# Altium schematic sheet Sheet1.SchDoc
size A2; SheetNumber: 1; SheetTotal: 1
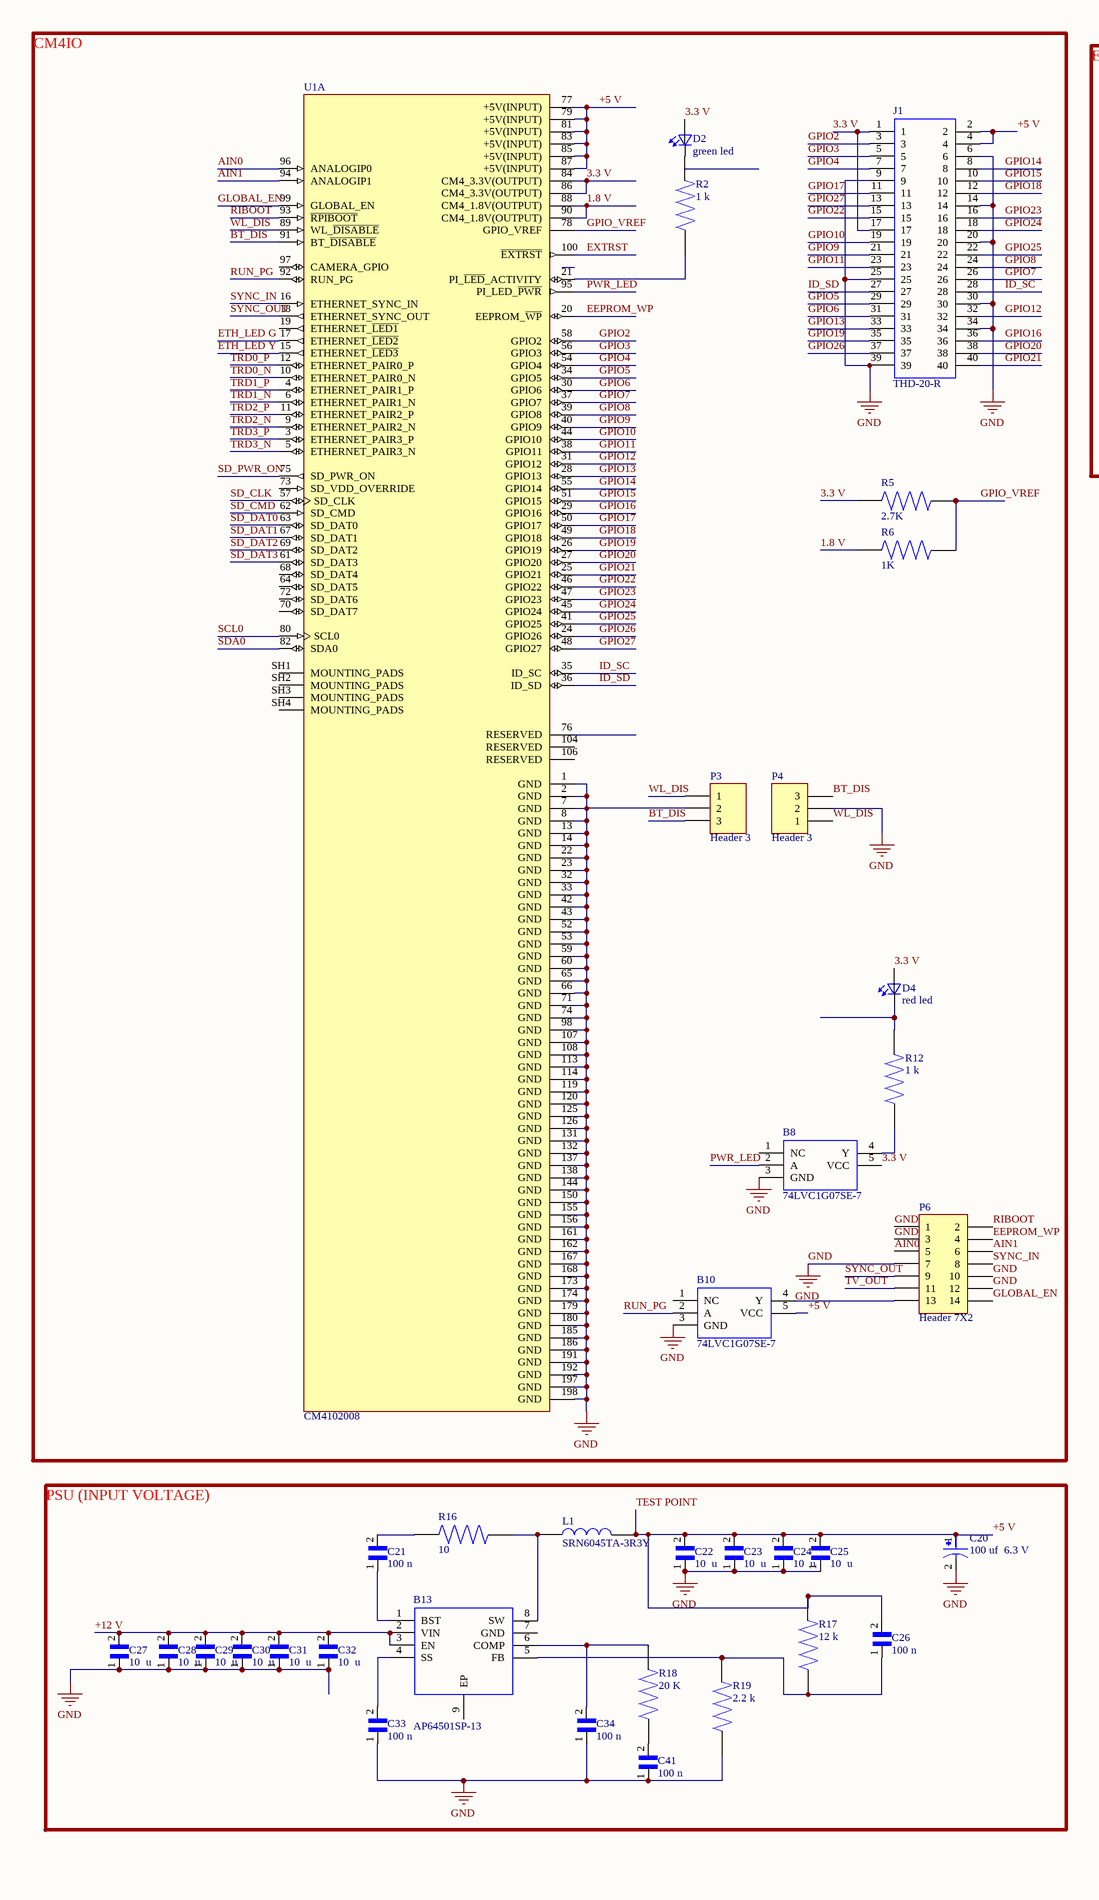
[diagram p0: Sheet1.SchDoc, left]
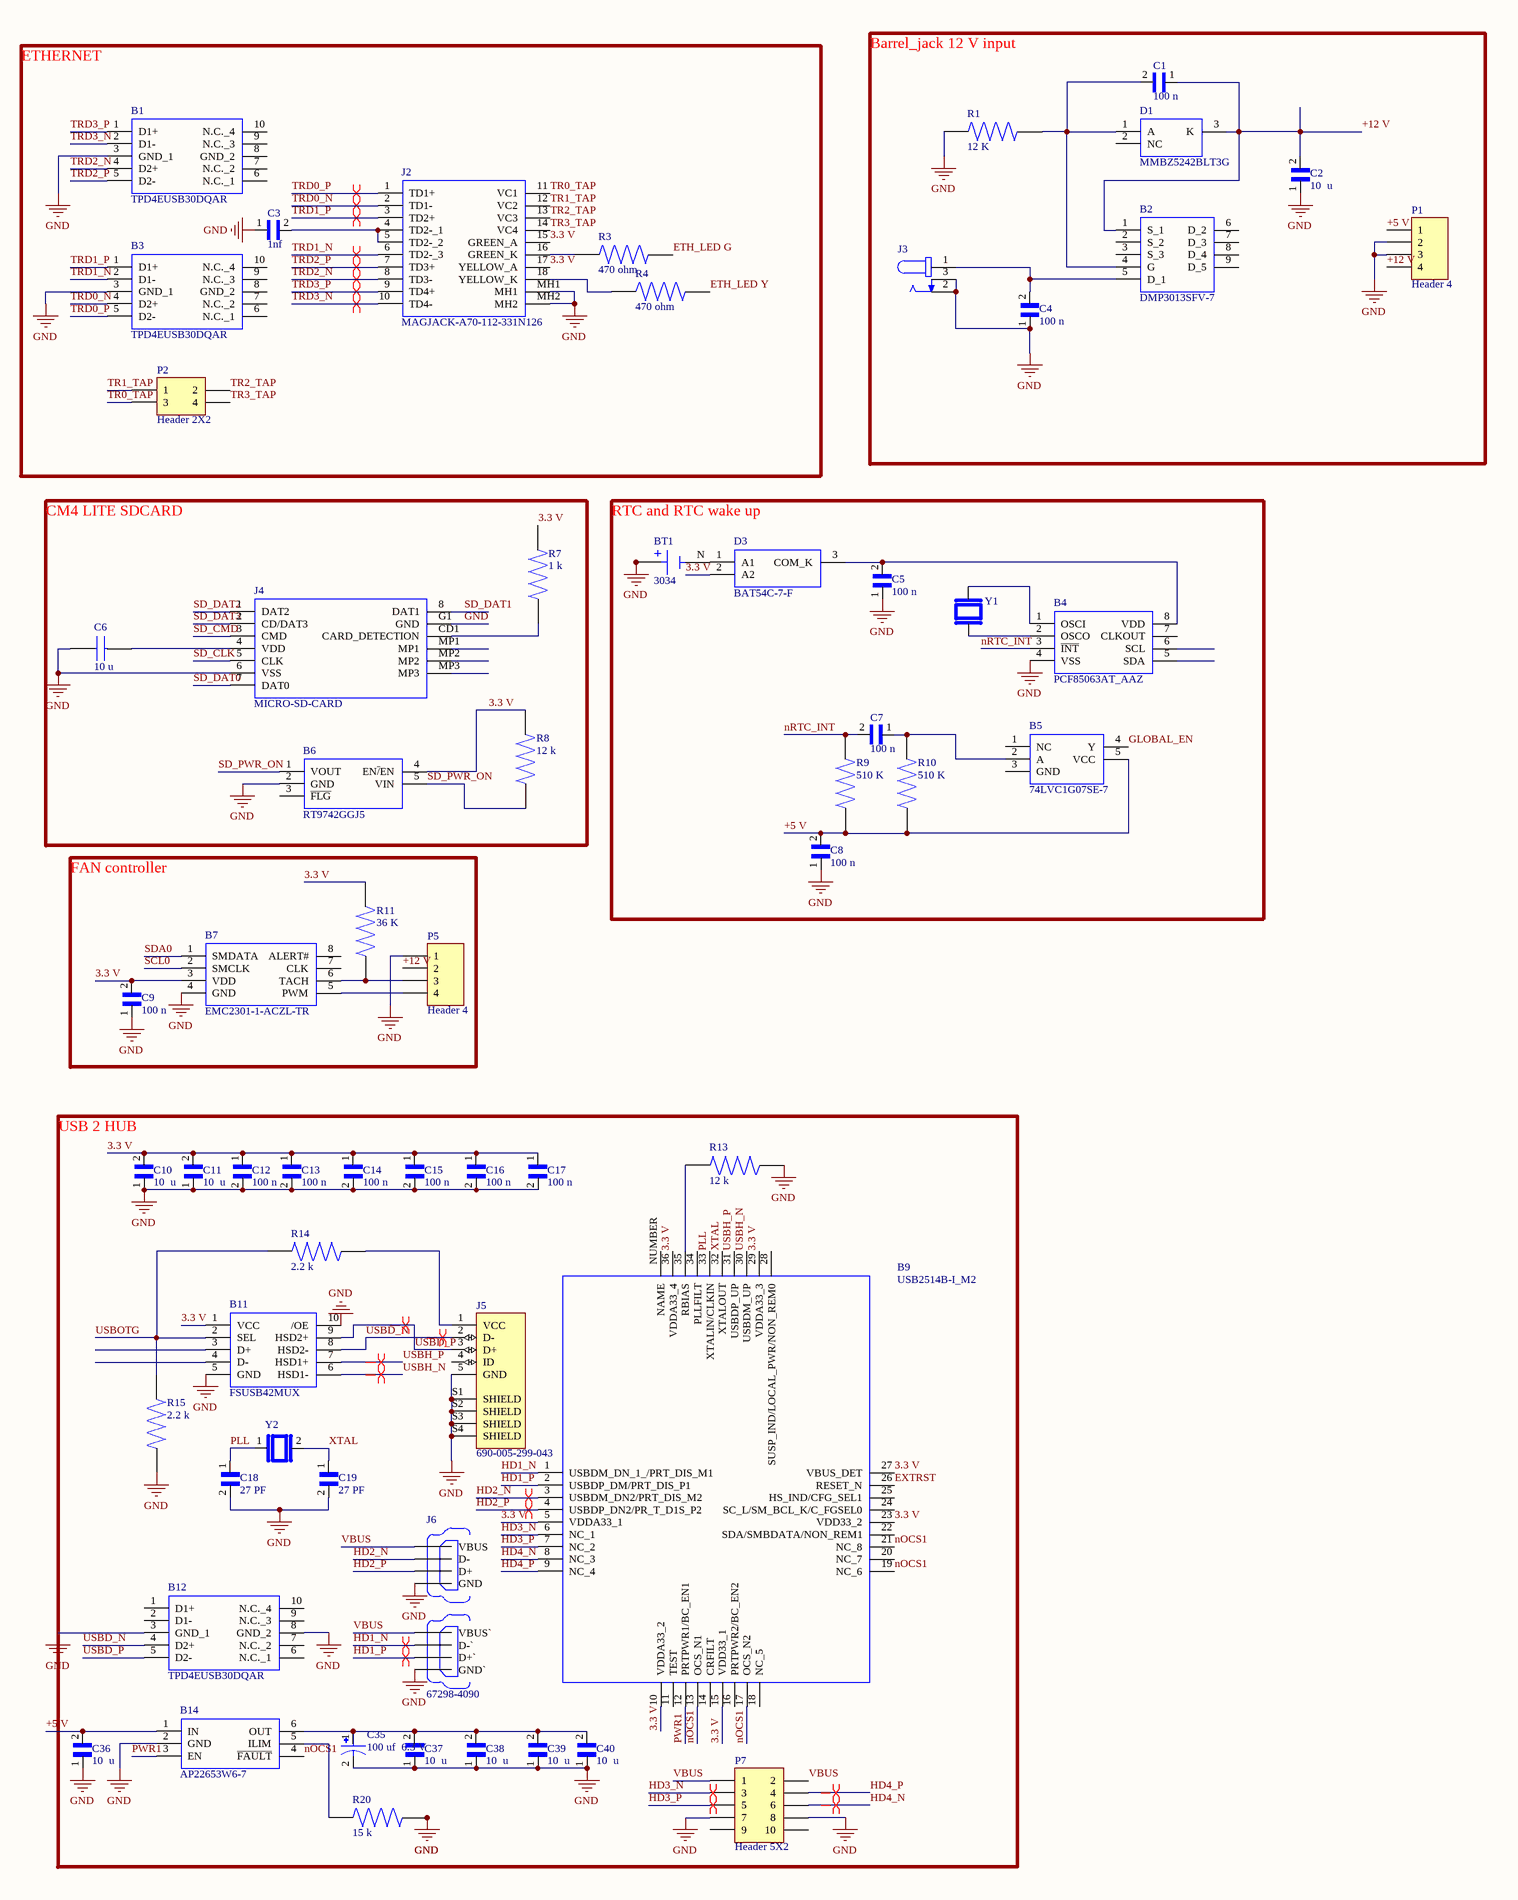
[diagram p1: Sheet1.SchDoc, right]

## Parts
B1  TPD4EUSB30DQAR  [DQA(R-PUSON-N10)]
B2  DMP3013SFV-7  [DMP3036SFV7]
B3  TPD4EUSB30DQAR  [DQA(R-PUSON-N10)]
B4  PCF85063AT_AAZ  [SOIC127P600X175-8N]
B5  74LVC1G07SE-7  [SOT65P210X110-5N]
B6  RT9742GGJ5  [SOT94P280X100-5N]
B7  EMC2301-1-ACZL-TR  [SOP65P490X110-8N]
B8  74LVC1G07SE-7  [SOT65P210X110-5N]
B9  USB2514B-I_M2  [QFN50P600X600X100-37N-D]
B10  74LVC1G07SE-7  [SOT65P210X110-5N]
B11  FSUSB42MUX  [SOP50P490X110-10N]
B12  TPD4EUSB30DQAR  [DQA(R-PUSON-N10)]
B13  AP64501SP-13  [SOIC127P600X163-9N]
B14  AP22653W6-7  [SOT95P280X145-6N]
BT1  3034  [BAT_3034]
C1  100 n  [CAPC1005X55N]
C2  10  u  [CAPC1005X55N]
C3  1nf  [CAPC1005X55N]
C4  100 n  [CAPC1005X55N]
C5  100 n  [CAPC1005X55N]
C6  10 u  [CAPC2012X145N]
C7  100 n  [CAPC1005X55N]
C8  100 n  [CAPC1005X55N]
C9  100 n  [CAPC1005X55N]
C10  10  u  [CAPC1005X55N]
C11  10  u  [CAPC1005X55N]
C12  100 n  [CAPC1005X55N]
C13  100 n  [CAPC1005X55N]
C14  100 n  [CAPC1005X55N]
C15  100 n  [CAPC1005X55N]
C16  100 n  [CAPC1005X55N]
C17  100 n  [CAPC1005X55N]
C18  27 PF  [CAPC1005X55N]
C19  27 PF  [CAPC1005X55N]
C20  100 uf  6.3 V  [CAPMP3528X210N]
C21  100 n  [CAPC1005X55N]
C22  10  u  [CAPC1005X55N]
C23  10  u  [CAPC1005X55N]
C24  10  u  [CAPC1005X55N]
C25  10  u  [CAPC1005X55N]
C26  100 n  [CAPC1005X55N]
C27  10  u  [CAPC1005X55N]
C28  10  u  [CAPC1005X55N]
C29  10  u  [CAPC1005X55N]
C30  10  u  [CAPC1005X55N]
C31  10  u  [CAPC1005X55N]
C32  10  u  [CAPC1005X55N]
C33  100 n  [CAPC1005X55N]
C34  100 n  [CAPC1005X55N]
C35  100 uf  6.3 V  [CAPMP3528X210N]
C36  10  u  [CAPC1005X55N]
C37  10  u  [CAPC1005X55N]
C38  10  u  [CAPC1005X55N]
C39  10  u  [CAPC1005X55N]
C40  10  u  [CAPC1005X55N]
C41  100 n  [CAPC1005X55N]
D1  MMBZ5242BLT3G  [SOT96P237X111-3N]
D2  green led  [0603]
D3  BAT54C-7-F  [SOT96P240X115-3N]
D4  red led  [0603]
J1  THD-20-R  [HDRV40W66P254_2X20_5080X500X890P]
J2  MAGJACK-A70-112-331N126  [EDAC_A70-112-331N126]
J3  DCJ200-10-A-XX-K_REVA  [GCT_DCJ200-10-A-XX-K_REVA]  (value not drawn)
J4  MICRO-SD-CARD  [MICROSDCARD]
J5  690-005-299-043  [EDAC_690-005-299-043]
J6  67298-4090  [MOLEX_67298-4090]
L1  SRN6045TA-3R3Y  [SRN6045TA330M]
P1  Header 4  [HDR1X4]
P2  Header 2X2  [HDR2X2]
P3  Header 3  [HDR1X3]
P4  Header 3  [HDR1X3]
P5  Header 4  [HDR1X4]
P6  Header 7X2  [HDR2X7]
P7  Header 5X2  [HDR2X5]
R1  12 K  [RESC2012X65N]
R2  1 k  [RESC1005X35N]
R3  470 ohm  [RESC2012X65N]
R4  470 ohm  [RESC2012X65N]
R5  2.7K  [RESC2012X65N]
R6  1K  [RESC2012X65N]
R7  1 k  [RESC1005X35N]
R8  12 k  [RESC2012X65N]
R9  510 K  [RESC1005X35N]
R10  510 K  [RESC1005X35N]
R11  36 K  [RESC1005X35N]
R12  1 k  [RESC1005X35N]
R13  12 k  [RESC2012X65N]
R14  2.2 k  [RESC2012X65N]
R15  2.2 k  [RESC2012X65N]
R16  10  [RESC2012X65N]
R17  12 k  [RESC2012X65N]
R18  20 K  [RESC2012X65N]
R19  2.2 k  [RESC1005X35N]
R20  15 k  [RESC2012X65N]
U1  CM4102008  [MODULE_CM4102008]  (part A of 2)
Y1  CM7V-T1A-32.768KHZ-12.5PF-10PPM-TB-QC  [XTAL_CM7V-T1A-32.768KHZ-12.5PF-10PPM-TB-QC]  (value not drawn)
Y2  FOXSDLF/240F-20  [XTAL_FOXSDLF/240F-20]  (value not drawn)

## Nets
GND: B1.3(GND_1) B3.3(GND_1) B4.4(VSS) B6.2(GND) B7.4(GND) B8.3(GND) B10.3(GND) B11.5(GND) B11.10(/OE) B12.3(GND_1) B12.8(GND_2) B14.2(GND) BT1.P1(POS) BT1.P2(POS) C2.1 C3.1 C4.1 C5.1 C6.1 C8.1 C9.1 C10.1 C11.1 C12.2 C13.2 C14.2 C15.2 C16.2 C17.2 C18.2 C19.2 C20.2 C22.1 C23.1 C24.1 C25.1 C27.1 C28.1 C29.1 C30.1 C31.1 C32.1 C33.1 C34.1 C35.2 C36.1 C37.1 C38.1 C39.1 C40.1 C41.1 J1.6 J1.9 J1.14 J1.20 J1.25 J1.30 J1.34 J1.39 J2.MH1 J2.MH2 J3.2 J3.3 J4.6(VSS) J4.G1(GND) J5.5(GND) J5.S1(SHIELD) J5.S2(SHIELD) J5.S3(SHIELD) J5.S4(SHIELD) J6.4(GND`) J6.8(GND) P1.2 P1.3 P3.2 P4.2 P5.1 P6.1 P6.3 P6.7 P6.10 P6.12 P7.7 P7.8 R1.1 R13.1 R15.2 R19.1 R20.2 U1.1(GND) U1.2(GND) U1.7(GND) U1.8(GND) U1.13(GND) U1.14(GND) U1.22(GND) U1.23(GND) U1.32(GND) U1.33(GND) U1.42(GND) U1.43(GND) U1.52(GND) U1.53(GND) U1.59(GND) U1.60(GND) U1.65(GND) U1.66(GND) U1.71(GND) U1.74(GND) U1.98(GND) U1.107(GND) U1.108(GND) U1.113(GND) U1.114(GND) U1.119(GND) U1.120(GND) U1.125(GND) U1.126(GND) U1.131(GND) U1.132(GND) U1.137(GND) U1.138(GND) U1.144(GND) U1.150(GND) U1.155(GND) U1.156(GND) U1.161(GND) U1.162(GND) U1.167(GND) U1.168(GND) U1.173(GND) U1.174(GND) U1.179(GND) U1.180(GND) U1.185(GND) U1.186(GND) U1.191(GND) U1.192(GND) U1.197(GND) U1.198(GND)
1.8 V: R6.1 U1.88(CM4_1.8V(OUTPUT)) U1.90(CM4_1.8V(OUTPUT))
3.3 V: B6.4(EN~{/}EN) B7.3(VDD) B8.5(VCC) B9.5(VDDA33_1) B9.10(VDDA33_2) B9.15(VDD33_1) B9.23(VDD33_2) B9.27(VBUS_DET) B9.29(VDDA33_3) B9.36(VDDA33_4) B11.1(VCC) C9.2 C10.2 C11.2 C12.1 C13.1 C14.1 C15.1 C16.1 C17.1 D2.2(A2) D3.2(A2) D4.2(A2) J1.1 J1.17 J2.15(GREEN_A) J2.17(YELLOW_A) R5.1 R7.2 R8.2 R11.2 U1.84(CM4_3.3V(OUTPUT)) U1.86(CM4_3.3V(OUTPUT))
+5 V: B5.5(VCC) B10.5(VCC) B14.1(IN) C8.2 C20.1 C22.2 C23.2 C24.2 C25.2 C26.2 C36.2 J1.2 J1.4 L1.2 P1.1 R9.1 R10.1 R17.2 U1.77(+5V(INPUT)) U1.79(+5V(INPUT)) U1.81(+5V(INPUT)) U1.83(+5V(INPUT)) U1.85(+5V(INPUT)) U1.87(+5V(INPUT))  [also labelled TEST POINT]
+12 V: B2.1(S_1) B13.2(VIN) B13.3(EN) C1.1 C2.2 C27.2 C28.2 C29.2 C30.2 C31.2 C32.2 D1.3(K) P1.4 P5.2
AIN0: P6.5 U1.96(ANALOGIP0)
AIN1: P6.6 U1.94(ANALOGIP1)
BT_DIS: P3.3 P4.3 U1.91(BT_~{DISABLE})
EEPROM_WP: P6.4 U1.20(EEPROM_~{WP})
ETH_LED G: R3.2 U1.17(ETHERNET_~{LED2})
ETH_LED Y: R4.2 U1.15(ETHERNET_~{LED3})
EXTRST: B9.26(RESET_N) U1.100(~{EXTRST})
GLOBAL_EN: B5.4(Y) P6.14 U1.99(GLOBAL_EN)
GPIO2: J1.3 U1.58(GPIO2)
GPIO3: J1.5 U1.56(GPIO3)
GPIO4: J1.7 U1.54(GPIO4)
GPIO5: J1.29 U1.34(GPIO5)
GPIO6: J1.31 U1.30(GPIO6)
GPIO7: J1.26 U1.37(GPIO7)
GPIO8: J1.24 U1.39(GPIO8)
GPIO9: J1.21 U1.40(GPIO9)
GPIO10: J1.19 U1.44(GPIO10)
GPIO11: J1.23 U1.38(GPIO11)
GPIO12: J1.32 U1.31(GPIO12)
GPIO13: J1.33 U1.28(GPIO13)
GPIO14: J1.8 U1.55(GPIO14)
GPIO15: J1.10 U1.51(GPIO15)
GPIO16: J1.36 U1.29(GPIO16)
GPIO17: J1.11 U1.50(GPIO17)
GPIO18: J1.12 U1.49(GPIO18)
GPIO19: J1.35 U1.26(GPIO19)
GPIO20: J1.38 U1.27(GPIO20)
GPIO21: J1.40 U1.25(GPIO21)
GPIO22: J1.15 U1.46(GPIO22)
GPIO23: J1.16 U1.47(GPIO23)
GPIO24: J1.18 U1.45(GPIO24)
GPIO25: J1.22 U1.41(GPIO25)
GPIO26: J1.37 U1.24(GPIO26)
GPIO27: J1.13 U1.48(GPIO27)
GPIO_VREF: R5.2 R6.2 U1.78(GPIO_VREF)
HD1_N: B9.1(USBDM_DN_1_/PRT_DIS_M1) J6.2(D-`)
HD1_P: B9.2(USBDP_DM/PRT_DIS_P1) J6.3(D+`)
HD2_N: B9.3(USBDM_DN2/PRT_DIS_M2) J6.6(D-)
HD2_P: B9.4(USBDP_DN2/PR_T_D1S_P2) J6.7(D+)
HD3_N: B9.6(NC_1) P7.3
HD3_P: B9.7(NC_2) P7.5
HD4_N: B9.8(NC_3) P7.6
HD4_P: B9.9(NC_4) P7.4
ID_SC: J1.28 U1.35(ID_SC)
ID_SD: J1.27 U1.36(ID_SD)
nOCS1: B9.13(OCS_N1) B9.17(OCS_N2) B9.19(NC_6) B9.21(NC_8) B14.4(~{FAULT})
nRTC_INT: B4.3(~{INT}) C7.2 R9.2
PLL: B9.33(XTALIN/CLKIN) C18.1 Y2.1
PWR1: B9.12(PRTPWR1/BC_EN1) B14.3(EN)
PWR_LED: B8.2(A) U1.95(PI_LED_~{PWR})
RIBOOT: P6.2 U1.93(~{RPIBOOT})
RUN_PG: B10.2(A) U1.92(RUN_PG)
SCL0: B7.2(SMCLK) U1.80(SCL0)
SD_CLK: J4.5(CLK) U1.57(SD_CLK)
SD_CMD: J4.3(CMD) U1.62(SD_CMD)
SD_DAT0: J4.7(DAT0) U1.63(SD_DAT0)
SD_DAT1: J4.8(DAT1) U1.67(SD_DAT1)
SD_DAT2: J4.1(DAT2) U1.69(SD_DAT2)
SD_DAT3: J4.2(CD/DAT3) U1.61(SD_DAT3)
SD_PWR_ON: B6.1(VOUT) B6.5(VIN) R8.1 U1.75(SD_PWR_ON)
SDA0: B7.1(SMDATA) U1.82(SDA0)
SYNC_IN: P6.8 U1.16(ETHERNET_SYNC_IN)
SYNC_OUT: P6.9 U1.18(ETHERNET_SYNC_OUT)
TR0_TAP: J2.11(VC1) P2.3
TR1_TAP: J2.12(VC2) P2.1
TR2_TAP: J2.13(VC3) P2.2
TR3_TAP: J2.14(VC4) P2.4
TRD0_N: B3.4(D2+) J2.2(TD1-) U1.10(ETHERNET_PAIR0_N)
TRD0_P: B3.5(D2-) J2.1(TD1+) U1.12(ETHERNET_PAIR0_P)
TRD1_N: B3.2(D1-) J2.6(TD2-_3) U1.6(ETHERNET_PAIR1_N)
TRD1_P: B3.1(D1+) J2.3(TD2+) U1.4(ETHERNET_PAIR1_P)
TRD2_N: B1.4(D2+) J2.8(TD3-) U1.9(ETHERNET_PAIR2_N)
TRD2_P: B1.5(D2-) J2.7(TD3+) U1.11(ETHERNET_PAIR2_P)
TRD3_N: B1.2(D1-) J2.10(TD4-) U1.5(ETHERNET_PAIR3_N)
TRD3_P: B1.1(D1+) J2.9(TD4+) U1.3(ETHERNET_PAIR3_P)
TV_OUT: P6.11
USBD_N: B11.8(HSD2-) B12.4(D2+) J5.2(D-)
USBD_P: B11.9(HSD2+) B12.5(D2-) J5.3(D+)
USBH_N: B9.30(USBDM_UP) B11.6(HSD1-)
USBH_P: B9.31(USBDP_UP) B11.7(HSD1+)
USBOTG: B11.2(SEL) R14.2 R15.1
VBUS: J6.1(VBUS`) J6.5(VBUS) P7.1 P7.2
WL_DIS: P3.1 P4.1 U1.89(WL_~{DISABLE})
XTAL: B9.32(XTALOUT) C19.1 Y2.2
NetB2_4: B2.4(G) C1.2 D1.1(A) R1.2
NetB2_5: B2.5(D_1) C4.2 J3.1
NetB4_1: B4.1(OSCI) Y1.2
NetB4_2: B4.2(OSCO) Y1.1
NetB4_8: B4.8(VDD) C5.2 D3.3(COM_K)
NetB5_2: B5.2(A) C7.1 R10.2
NetB7_5: B7.5(PWM) P5.4
NetB7_6: B7.6(TACH) P5.3 R11.1
NetB8_4: B8.4(Y) R12.1
NetB9_35: B9.35(RBIAS) R13.2
NetB10_4: B10.4(Y) P6.13
NetB13_1: B13.1(BST) C21.1
NetB13_4: B13.4(SS) C33.2
NetB13_5: B13.5(FB) C26.1 R17.1 R19.2
NetB13_6: B13.6(COMP) C34.2 R18.2
NetB13_8: B13.8(SW) L1.1 R16.2
NetB14_5: B14.5(ILIM) R20.1
NetB14_6: B14.6(OUT) C35.1 C37.2 C38.2 C39.2 C40.2
NetBT1_N: BT1.N(NEG) D3.1(A1)
NetC3_2: C3.2 J2.4(TD2-_1) J2.5(TD2-_2)
NetC6_2: C6.2 J4.4(VDD)
NetC21_2: C21.2 R16.1
NetC41_2: C41.2 R18.1
NetD2_1: D2.1(K2) R2.2
NetD4_1: D4.1(K2) R12.2
NetJ2_16: J2.16(GREEN_K) R3.1
NetJ2_18: J2.18(YELLOW_K) R4.1
NetJ4_CD1: J4.CD1(CARD_DETECTION) R7.1
NetJ5_1: J5.1(VCC) R14.1
NetR2_1: R2.1 U1.21(PI_~{LED}_ACTIVITY)

Not connected (* = marked no-connect by the designer): B1 6(N.C._1) 7(N.C._2) 8(GND_2) 9(N.C._3) 10(N.C._4); B2 2(S_2) 3(S_3) 6(D_2) 7(D_3) 8(D_4) 9(D_5); B3 6(N.C._1) 7(N.C._2) 8(GND_2) 9(N.C._3) 10(N.C._4); B4 5(SDA) 6(SCL) 7(CLKOUT); B5 1(NC) 3(GND); B6 3(~{FLG}); B7 7(CLK) 8(ALERT#); B8 1(NC); B9 11(TEST) 14(CRFILT) 16(PRTPWR2/BC_EN2) 18(NC_5) 20(NC_7) 22(SDA/SMBDATA/NON_REM1) 24(SC_L/SM_BCL_K/C_FGSEL0) 25(HS_IND/CFG_SEL1) 28(SUSP_IND/LOCAL_PWR/NON_REM0) 34(PLLFILT) NUMBER(NAME); B10 1(NC); B11 3(D+) 4(D-); B12 1(D1+) 2(D1-) 6(N.C._1) 7(N.C._2) 9(N.C._3) 10(N.C._4); B13 7(GND) 9(EP); D1 2(NC); J4 MP1 MP2 MP3; J5 4(ID); P7 9 10; U1 19(ETHERNET_~{LED1}) 64(SD_DAT5) 68(SD_DAT4) 70(SD_DAT7) 72(SD_DAT6) 73(SD_VDD_OVERRIDE) 76(RESERVED) 97(CAMERA_GPIO) 104(RESERVED) 106(RESERVED) SH1(MOUNTING_PADS) SH2(MOUNTING_PADS) SH3(MOUNTING_PADS) SH4(MOUNTING_PADS)

## Layout directives
differential pair: HD1_N, HD1_P, HD2_N, HD2_P, HD3_N, HD3_P, HD4_N, HD4_P, TRD0_N, TRD0_P, TRD1_N, TRD1_P, TRD2_N, TRD2_P, TRD3_N, TRD3_P, USBD_N, USBD_P, USBH_N, USBH_P

## Notes on the sheet
- Barrel_jack 12 V input
- ETHERNET
- CM4 LITE SDCARD
- RTC and RTC wake up
- FAN controller
- CM4IO
- PSU (INPUT VOLTAGE)
- USB 2 HUB

## Library data of the parts
B1 B3 B12 = TPD4EUSB30DQAR: Texas Instruments TPD4EUSB30DQAR, USB Controller, 6Gbit/s, USB 3.0, 10-Pin SON; Manufacturer_Name: Texas Instruments; Manufacturer_Part_Number: TPD4EUSB30DQAR; Mouser Part Number: 595-TPD4EUSB30DQAR; Mouser Price/Stock: https://www.mouser.co.uk/ProductDetail/Texas-Instruments/TPD4EUSB30DQAR?qs=Ze4%2FuFuz19JpY4uqYOLMbQ%3D%3D; Arrow Part Number: TPD4EUSB30DQAR; Arrow Price/Stock: https://www.arrow.com/en/products/tpd4eusb30dqar/texas-instruments?utm_currency=USD&region=nac; Datasheet Link: http://www.ti.com/lit/gpn/tpd4eusb30
B2 = DMP3013SFV-7: Trans MOSFET P-CH 30V 12A 8-Pin PowerDI EP T/R; Manufacturer_Name: Diodes Incorporated; Manufacturer_Part_Number: DMP3013SFV-7; Mouser Part Number: 621-DMP3013SFV-7; Mouser Price/Stock: https://www.mouser.co.uk/ProductDetail/Diodes-Incorporated/DMP3013SFV-7?qs=W0yvOO0ixfH1hnmiAtL1VQ%3D%3D; Arrow Part Number: DMP3013SFV-7; Arrow Price/Stock: https://www.arrow.com/en/products/dmp3013sfv-7/diodes-incorporated?utm_currency=USD&region=nac; Datasheet Link: https://www.diodes.com//assets/Datasheets/DMP3013SFV.pdf
B4 = PCF85063AT_AAZ: Real Time Clock Low Power Real time clocks; Manufacturer_Name: NXP; Manufacturer_Part_Number: PCF85063AT/AAZ; Geometry.Height: 1.75mm; Mouser Part Number: 771-PCF85063AT/AAZ; Mouser Price/Stock: https://www.mouser.co.uk/ProductDetail/NXP-Semiconductors/PCF85063AT-AAZ?qs=sV%252BQJnSpgu9E5WpV9lmUdg%3D%3D; Arrow Part Number: PCF85063AT/AAZ; Arrow Price/Stock: https://www.arrow.com/en/products/pcf85063ataaz/nxp-semiconductors?region=nac; Datasheet Link: http://www.nxp.com/docs/en/data-sheet/PCF85063A.pdf
B5 B8 B10 = 74LVC1G07SE-7: Buffers & Line Drivers Single Gate Open Out 1.65 to 5.5V 32mA; Manufacturer_Name: Diodes Incorporated; Geometry.Height: 1.1mm; Manufacturer_Part_Number: 74LVC1G07SE-7; Mouser Part Number: 621-74LVC1G07SE-7; Mouser Price/Stock: https://www.mouser.co.uk/ProductDetail/Diodes-Incorporated/74LVC1G07SE-7?qs=abZ1nkZpTuNoZmx9wrxFdA%3D%3D; Arrow Part Number: 74LVC1G07SE-7; Arrow Price/Stock: https://www.arrow.com/en/products/74lvc1g07se-7/diodes-incorporated?utm_currency=USD&region=europe; Datasheet Link: https://www.diodes.com//assets/Datasheets/74LVC1G07.pdf
B6 = RT9742GGJ5: POWER LOAD SWITCH, HIGH SIDE, TSOT-23-5; Power Load Switch Type:High Side; Input Voltage:6V; Current Limit:1.1A; On State Resistance:0.07ohm; Distribution Switch Case Style:TSOT-23; No. of Pins:5Pins; Thermal Protection:Yes; On / RoHS Compliant: Yes; Manufacturer_Name: RICHTEK; Geometry.Height: 1mm; Manufacturer_Part_Number: RT9742GGJ5; Mouser Part Number: 835-RT9742GGJ5; Mouser Price/Stock: https://www.mouser.co.uk/ProductDetail/Richtek/RT9742GGJ5?qs=amGC7iS6iy%2FZU2tAnLZxIA%3D%3D; Arrow Part Number: *; Arrow Price/Stock: *; Datasheet Link: https://componentsearchengine.com/Datasheets/2/RT9742GGJ5.pdf
B7 = EMC2301-1-ACZL-TR: RPM-Based PWM Fan Speed Controller MSOP8; Manufacturer_Name: Microchip; Geometry.Height: 1.1mm; Manufacturer_Part_Number: EMC2301-1-ACZL-TR; Mouser Part Number: 886-EMC2301-1-ACZLTR; Mouser Price/Stock: https://www.mouser.co.uk/ProductDetail/Microchip-Technology/EMC2301-1-ACZL-TR?qs=pA5MXup5wxFdFYiBpDRrfw%3D%3D; Arrow Part Number: EMC2301-1-ACZL-TR; Arrow Price/Stock: https://www.arrow.com/en/products/emc2301-1-aczl-tr/microchip-technology?region=nac; Datasheet Link: http://www.microchip.com/mymicrochip/filehandler.aspx?ddocname=en562400
B9 = USB2514B-I_M2: Microchip USB2514B-I/M2, USB Controller, USB 2.0, 3.3 V, 36-Pin SQFN; Geometry.Height: 1mm; Manufacturer_Name: Microchip; Manufacturer_Part_Number: USB2514B-I/M2; Mouser Part Number: 579-USB2514B-I/M2; Mouser Price/Stock: https://www.mouser.co.uk/ProductDetail/Microchip-Technology/USB2514B-I-M2?qs=uus7iwvxYD%252BYUekNs2mWlw%3D%3D; Arrow Part Number: USB2514B-I/M2; Arrow Price/Stock: https://www.arrow.com/en/products/usb2514b-im2/microchip-technology?region=nac; Datasheet Link: http://ww1.microchip.com/downloads/en/DeviceDoc/00001692C.pdf
B11 = FSUSB42MUX: 15A Maximum ICCT over and Expanded Control Voltage Range (VIN= 1.8V, VCC= 4.3V) ; Packaged in: ; Low On Resistance: 3.9 Typical ; 8kV ESD Rating, >16kV Power/GND ESD Rating ; 10-Lead MSOP ; Low Power Consumption: 1A Maximum ; Wide -3dB Bandwitch: > 720MHz ; Low On Capacitance: 3.7pF Typical ; Over-Voltage Tolerance (OVT) on all USB Ports Up to 5.25V without External Components; 10-Lead UMLP (1.4 x 1.8mm); Manufacturer_Name: onsemi; Geometry.Height: 1.1mm; Manufacturer_Part_Number: FSUSB42MUX; Mouser Part Number: 512-FSUSB42MUX; Mouser Price/Stock: https://www.mouser.co.uk/ProductDetail/onsemi-Fairchild/FSUSB42MUX?qs=yA6kp8fx8Y59RAD4iJDRWg%3D%3D; Arrow Part Number: FSUSB42MUX; Arrow Price/Stock: https://www.arrow.com/en/products/fsusb42mux/on-semiconductor?utm_currency=USD&region=nac; Datasheet Link: https://www.onsemi.com/pub/Collateral/FSUSB42-D.PDF
B13 = AP64501SP-13: Conv DC-DC 3.8V to 40V Synchronous Step Down Single-Out 0.8V to 39V 5A 8-Pin SO EP T/R; Manufacturer_Name: Diodes Incorporated; Geometry.Height: 1.63mm; Manufacturer_Part_Number: AP64501SP-13; Mouser Part Number: 621-AP64501SP-13; Mouser Price/Stock: https://www.mouser.co.uk/ProductDetail/Diodes-Incorporated/AP64501SP-13?qs=P1JMDcb91o7FS0GU%252BW7TIQ%3D%3D; Arrow Part Number: AP64501SP-13; Arrow Price/Stock: https://www.arrow.com/en/products/ap64501sp-13/diodes-incorporated?utm_currency=USD&region=nac; Datasheet Link: https://www.diodes.com//assets/Datasheets/AP64501.pdf
B14 = AP22653W6-7: Power Switch ICs - Power Distribution 1-Ch Precision Curr-Limit Load SW; Manufacturer_Name: Diodes Incorporated; Geometry.Height: 1.45mm; Manufacturer_Part_Number: AP22653W6-7; Mouser Part Number: 621-AP22653W6-7; Mouser Price/Stock: https://www.mouser.co.uk/ProductDetail/Diodes-Incorporated/AP22653W6-7?qs=rkhjVJ6%2F3ELFrpB7eThLLg%3D%3D; Arrow Part Number: AP22653W6-7; Arrow Price/Stock: null?region=asia; Datasheet Link: https://www.diodes.com//assets/Datasheets/AP22652_53_52A_53A.pdf
BT1 = 3034: SMT Holder for 20mm Cell-Tin Nickel Plate; MF: Keystone Electronics Corp.; SnapEDA_Link: https://www.snapeda.com/parts/3034/Keystone+Electronics/view-part/?ref=snap; Price: None; MP: 3034; Check_prices: https://www.snapeda.com/parts/3034/Keystone+Electronics/view-part/?ref=eda; Availability: Not in stock; Value: *; Package: None
C1 C3-C5 C7-C9 C12-C19 C21 C26 C33 C34 C41 = C1005X7R1C104M050BC: C Series 0402 0.1 uF 16 V Â±20 % Tolerance X7R SMT Multilayer Ceramic Capacitor; MF: TDK; MP: C1005X7R1C104M050BC; SnapEDA_Link: https://www.snapeda.com/parts/C1005X7R1C104M050BC/TDK/view-part/?ref=snap; Check_prices: https://www.snapeda.com/parts/C1005X7R1C104M050BC/TDK/view-part/?ref=eda; Price: None; Availability: In Stock; Purchase-URL: https://pricing.snapeda.com/search/part/C1005X7R1C104M050BC/?ref=eda; Package: 1005 TDK; Value: *
C2 C10 C11 C22-C25 C27-C32 C36-C40 = C2012X6S1C106K125AC: C Series 0805 10 uF 16 V Â±10 % Tolerance X6S SMT Multilayer Ceramic Capacitor; MF: TDK; MP: C2012X6S1C106K125AC; SnapEDA_Link: https://www.snapeda.com/parts/C2012X6S1C106K125AC/TDK-Lambda+Americas+Inc/view-part/?ref=snap; Check_prices: https://www.snapeda.com/parts/C2012X6S1C106K125AC/TDK-Lambda+Americas+Inc/view-part/?ref=eda; Value: *; Purchase-URL: https://pricing.snapeda.com/search/part/C2012X6S1C106K125AC/?ref=eda; Package: 2012 TDK
C6 = GRM21BC8YA106ME11L: Multilayer Ceramic Capacitors MLCC - SMD/SMT 0805 10uF 35volts *Derate Voltage/Temp; Manufacturer_Name: Murata Electronics; Geometry.Height: 1.45mm; Mouser Part Number: 81-GRM21BC8YA106ME1L; Mouser Price/Stock: https://www.mouser.co.uk/ProductDetail/Murata-Electronics/GRM21BC8YA106ME11L?qs=K0Sa7bCb58JXd%2FLXsBufTg%3D%3D; Manufacturer_Part_Number: GRM21BC8YA106ME11L; Datasheet Link: https://search.murata.co.jp/Ceramy/image/img/A01X/G101/ENG/GRM21BC8YA106ME11-01A.pdf
C20 C35 = T543B107K006AHW025: 100 ÂµF Molded Tantalum Polymer Capacitor 6.3 V 1411 (3528 Metric) 25mOhm @ 100kHz; MF: KEMET; SnapEDA_Link: https://www.snapeda.com/parts/T543B107K006AHW025/KEMET/view-part/?ref=snap; Package: SMD-2 Kemet; Value: *; MP: T543B107K006AHW025; Check_prices: https://www.snapeda.com/parts/T543B107K006AHW025/KEMET/view-part/?ref=eda
D1 = MMBZ5242BLT3G: 225 mW Rating on FR-4 or FR-5 Board; Zener Voltage Range - 2.4 V to 91 V; Package Designed for Optimal Automated Board Assembly; Small Package Size for High Density Applications; ESD Rating of Class 3 (>16 KV) per Human Body Model Mechanical Characteristics; CASE: Void-free, transfer-molded, thermosetting plastic case; FINISH: Corrosion resistant finish, easily solderable; MAXIMUM CASE TEMPERATURE FOR SOLDERING PURPOSES: 260C for 10 Seconds; POLARITY: Cathode indicated by polarity band; FLAMMABILITY RATING:; Manufacturer_Name: onsemi; Geometry.Height: 1.11mm; Manufacturer_Part_Number: MMBZ5242BLT3G; Mouser Part Number: 863-MMBZ5242BLT3G; Mouser Price/Stock: https://www.mouser.co.uk/ProductDetail/onsemi/MMBZ5242BLT3G?qs=P4IOph%252Bbot8zm7%252BOlKh6Qw%3D%3D; Arrow Part Number: MMBZ5242BLT3G; Arrow Price/Stock: https://www.arrow.com/en/products/mmbz5242blt3g/on-semiconductor?utm_currency=USD&region=nac; Datasheet Link: https://www.onsemi.com/pub/Collateral/MMBZ5221BLT1-D.PDF
D2 = LTST-S270KGKT: Green 571nm LED Indication - Discrete 2V 0603 _1608 Metric_; MF: Lite-On Inc.; MP: LTST-S270KGKT; Availability: Unavailable; SnapEDA_Link: https://www.snapeda.com/parts/LTST-S270KGKT/Lite-On%20Inc./view-part/268457/?ref=snap; Package: 0603 Lite-On; Price: None; Value: *
D3 = BAT54C-7-F: DiodesZetex   ,  30V, 3 SOT-23,  +150 C; Manufacturer_Name: Diodes Incorporated; Geometry.Height: 1.15mm; Manufacturer_Part_Number: BAT54C-7-F; Mouser Part Number: 621-BAT54C-F; Mouser Price/Stock: https://www.mouser.co.uk/ProductDetail/Diodes-Incorporated/BAT54C-7-F?qs=A%2FGeX6qn32NJhN9M%2F3GNcA%3D%3D; Arrow Part Number: BAT54C-7-F; Arrow Price/Stock: https://www.arrow.com/en/products/bat54c-7-f/diodes-incorporated?utm_currency=USD&region=nac; Datasheet Link: https://www.diodes.com//assets/Datasheets/BAT54_A_C_S.pdf
D4 = LTST-S270KRKT: http://octopart.com/ltst-c190tbkt-lite-on-550003; MF: {'manufacturer': u'Lite-On Inc.'}; Package: None; Price: None; Value: *; MP: LTST-S270KRKT; Availability: Unavailable
J1 = THD-20-R: 2.54MM ... PRPC040SBAN-M71RC, CONN HEADER R/A 40POS 2.54MM, Header, Breakaway, Male Pin, 0.100" (2.54mm), 40,; Manufacturer_Name: valcon; Geometry.Height: 8.9mm; Manufacturer_Part_Number: THD-20-R; Mouser Part Number: *; Mouser Price/Stock: *; Arrow Part Number: *; Arrow Price/Stock: *; Datasheet Link: https://datasheet.octopart.com/THD-20-R-Valcon-datasheet-116534095.pdf
J2 = MAGJACK-A70-112-331N126: 1 Port RJ45 Magjack Connector Through Hole 10/100 Base-T, AutoMDIX; Manufacturer_Name: Bel Magnetic Solutions; Geometry.Height: 13.3mm; Manufacturer_Part_Number: MAGJACK-A70-112-331N126; Mouser Part Number: *; Mouser Price/Stock: *; Arrow Part Number: *; Arrow Price/Stock: *; Datasheet Link: http://www.link-pp.com/upload/file/20180411/20180411182938293829.pdf
J3 = DCJ200-10-A-XX-K_REVA: Power Barrel Connector Jack 2.05mm ID (0.081), 5.50mm OD (0.217) Through Hole, Right Angle; MF: Global Connector Technology; MP: DCJ200-10-A-K1-K; SnapEDA_Link: https://www.snapeda.com/parts/DCJ200-10-A-K1-K/Global+Connector+Technology/view-part/?ref=snap; Package: None; Value: *; Check_prices: https://www.snapeda.com/parts/DCJ200-10-A-K1-K/Global+Connector+Technology/view-part/?ref=eda
J4 = MICRO-SD-CARD: Memory Card Connectors MICRO SD CARD CONNECTOR WITH PUSH PUSH EJECT ACTION; Manufacturer_Name: Olimex Ltd.; Geometry.Height: 2mm; Manufacturer_Part_Number: MICRO-SD-CARD; Mouser Part Number: N/A; Mouser Price/Stock: https://www.mouser.co.uk/ProductDetail/Olimex-Ltd/MICRO-SD-CARD?qs=Rp5uXu7WBW8fXUZTWj6z0w%3D%3D; Arrow Part Number: *; Arrow Price/Stock: *; Datasheet Link: https://www.olimex.com/Products/Components/Connectors/MICRO-SD-CARD/resources/MICRO-SDCARD-1.jpg
J5 = 690-005-299-043: USB - mini B USB 2.0 Receptacle Connector 5 Position Surface Mount, Right Angle; MF: EDAC Inc.; Price: None; Purchase-URL: https://pricing.snapeda.com/search/part/690-005-299-043/?ref=eda; Check_prices: https://www.snapeda.com/parts/690-005-299-043/EDAC%20Inc./view-part/347309/?ref=eda; Value: *; SnapEDA_Link: https://www.snapeda.com/parts/690-005-299-043/EDAC%20Inc./view-part/347309/?ref=snap; Availability: Good; MP: 690-005-299-043; Package: None
J6 = 67298-4090: USB-A (USB TYPE-A), Stacked - Receptacle Connector 8 Position Through Hole, Right Angle; MF: Molex; Check_prices: https://www.snapeda.com/parts/67298-4090/Molex/view-part/?ref=eda; Value: *; Purchase-URL: https://pricing.snapeda.com/search/part/67298-4090/?ref=eda; Price: None; MP: 67298-4090; SnapEDA_Link: https://www.snapeda.com/parts/67298-4090/Molex/view-part/?ref=snap; Availability: In Stock; Package: None
L1 = SRN6045TA-3R3Y: BOURNS - SRN6045TA-3R3Y - INDUCTOR, AEC-Q200, 3.3UH, 5A, 30% Semi-shielded Power Inductors; Geometry.Height: 4.5mm; Manufacturer_Name: Bourns; Manufacturer_Part_Number: SRN6045TA-3R3Y; Mouser Part Number: 652-SRN6045TA-3R3Y; Mouser Price/Stock: https://www.mouser.co.uk/ProductDetail/Bourns/SRN6045TA-3R3Y?qs=Vt59ZOdFuWZ4MyJAxNBCDg%3D%3D; Arrow Part Number: SRN6045TA-3R3Y; Arrow Price/Stock: https://www.arrow.com/en/products/srn6045ta-3r3y/bourns?utm_currency=USD&region=europe; Datasheet Link: http://www.bourns.com/docs/Product-Datasheets/SRN6045TA.pdf
P1 P5 = Header 4: Header, 4-Pin; LatestRevisionDate: 17-Jul-2002; LatestRevisionNote: Re-released for DXP Platform.; Publisher: Altium Limited
P2 = Header 2X2: Header, 2-Pin, Dual row; LatestRevisionDate: 17-Jul-2002; LatestRevisionNote: Re-released for DXP Platform.; Publisher: Altium Limited
P3 P4 = Header 3: Header, 3-Pin; LatestRevisionDate: 17-Jul-2002; LatestRevisionNote: Re-released for DXP Platform.; Publisher: Altium Limited
P6 = Header 7X2: Header, 7-Pin, Dual row; LatestRevisionDate: 17-Jul-2002; LatestRevisionNote: Re-released for DXP Platform.; Publisher: Altium Limited
P7 = Header 5X2: Header, 5-Pin, Dual row; LatestRevisionDate: 17-Jul-2002; LatestRevisionNote: Re-released for DXP Platform.; Publisher: Altium Limited
R1 R8 R13-R15 R17 R18 R20 = CPF0402B12K1E1: Surface Mount Thin Film Resistor, Cpf Series, 12.1 Kohm, 63 Mw, - 0.1%, 25 V; Package: None; Price: None; Value: *; MP: CPF0402B12K1E1; Availability: Unavailable
R2 R7 R9-R12 = CPF0402B1K1E1: CPF 0402 1K1 0.1% 25PPM 1K RL; Package: None; Price: None; Value: *; MP: CPF0402B1K1E1; Availability: Unavailable
R3 R4 = CPF0402B470RE1: CPF 0402 470R 0.1% 25PPM 1K RL; Package: None; Price: None; Value: *; MP: CPF0402B470RE1; Availability: Unavailable
R5 = CPF0805B2K7E1: RES SMD 2.7K OHM 0.1% 1/10W 0805; Package: None; Price: None; Value: *; MP: CPF0805B2K7E1; Availability: Unavailable
R6 R16 = CPF0805B20RE1: CPF 0805 20R 0.1% 25PPM 1K RL; Package: None; Price: None; Value: *; MP: CPF0805B20RE1; Availability: Unavailable
R19 = CPF0402B2K1E1: CPF 0402 2K1 0.1% 25PPM 1K RL; Package: None; Price: None; Value: *; MP: CPF0402B2K1E1; Availability: Unavailable
U1 = CM4102008: Raspberry Pi Compute Module 4 with WiFi 2GB RAM 8GB Flash | Raspberry Pi CM4102008; SnapEDA_Link: https://www.snapeda.com/parts/CM4102008/Raspberry+Pi/view-part/?ref=snap; Package: None; Value: *; MF: Raspberry Pi; MP: CM4102008; Check_prices: https://www.snapeda.com/parts/CM4102008/Raspberry+Pi/view-part/?ref=eda
Y1 = CM7V-T1A-32.768KHZ-12.5PF-10PPM-TB-QC: Tuning Fork Crystal 32.768kHz in SMD 1.5 x 3.2 mm package; MF: Micro Crystal; SnapEDA_Link: https://www.snapeda.com/parts/CM7V-T1A-32.768KHZ-12.5PF-10PPM-TB-QC/Micro+Crystal/view-part/?ref=snap; Package: SMD-2 Micro Crystal; Value: *; MP: CM7V-T1A-32.768KHZ-12.5PF-10PPM-TB-QC; Check_prices: https://www.snapeda.com/parts/CM7V-T1A-32.768KHZ-12.5PF-10PPM-TB-QC/Micro+Crystal/view-part/?ref=eda
Y2 = FOXSDLF/240F-20: 24 MHz Â±30 ppm Cristal 20 pF 30 ohmios HC-49/US; MF: Fox Electronics; SnapEDA_Link: https://www.snapeda.com/parts/FOXSDLF/240F-20/Fox+Electronics/view-part/?ref=snap; Package: HC49SD Fox Electronics; Value: *; MP: FOXSDLF/240F-20; Check_prices: https://www.snapeda.com/parts/FOXSDLF/240F-20/Fox+Electronics/view-part/?ref=eda